# Altium project usb_hub.PrjPCB
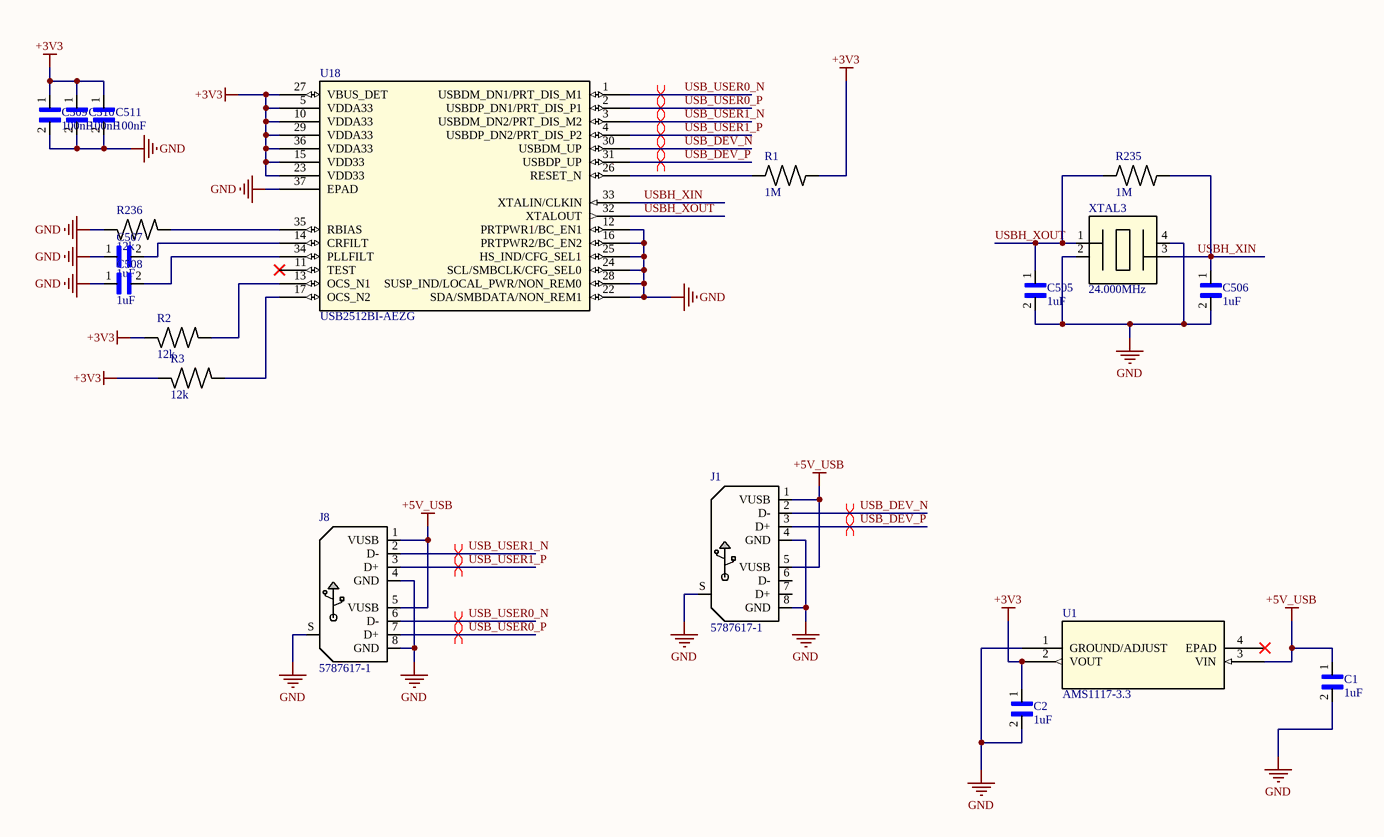
[diagram p0: usb_hub.SchDoc]
1 sheet, 19 parts. Net scope: global (net labels, ports and power ports of the same name join across sheets).
Board file: usb_hub.PcbDoc

## Sheet usb_hub.SchDoc
size A3

### Parts
C1  1uF  [*CAPC1608X90N]
C2  1uF  [*CAPC1608X90N]
C505  1uF  [*CAPC1608X90N]
C506  1uF  [*CAPC1608X90N]
C507  1uF  [*CAPC1608X90N]
C508  1uF  [*CAPC1608X90N]
C509  100nF  [*CAPC1608X90N]
C510  100nF  [*CAPC1608X90N]
C511  100nF  [*CAPC1608X90N]
J1  5787617-1  [CONN8_5787617-1_TEC]
J8  5787617-1  [CONN8_5787617-1_TEC]
R1  1M  [*RESC1608X55N]
R2  12k  [*RESC1608X55N]
R3  12k  [*RESC1608X55N]
R235  1M  [*RESC1608X55N]
R236  12k  [*RESC1608X55N]
U1  AMS1117-3.3  [SOT_AMS_ADS]
U18  USB2512BI-AEZG  [QFN36_6X6MC_MCH]
XTAL3  24.000MHz  [SMD-4_2P5X2_AVX]

### Nets
+3V3: C2.1 C509.1 C510.1 C511.1 R1.2 R2.1 R3.1 U1.2(VOUT) U18.5(VDDA33) U18.10(VDDA33) U18.15(VDD33) U18.23(VDD33) U18.27(VBUS_DET) U18.29(VDDA33) U18.36(VDDA33)
+5V_USB: C1.1 J1.1(VUSB) J1.5(VUSB) J8.1(VUSB) J8.5(VUSB) U1.3(VIN)
GND: C1.2 C2.2 C505.2 C506.2 C507.1 C508.1 C509.2 C510.2 C511.2 J1.4(GND) J1.8(GND) J1.S J8.4(GND) J8.8(GND) J8.S R236.1 U1.1(GROUND/ADJUST) U18.12(PRTPWR1/BC_EN1) U18.16(PRTPWR2/BC_EN2) U18.22(SDA/SMBDATA/NON_REM1) U18.24(SCL/SMBCLK/CFG_SEL0) U18.25(HS_IND/CFG_SEL1) U18.28(SUSP_IND/LOCAL_PWR/NON_REM0) U18.37(EPAD) XTAL3.2(GND) XTAL3.4(GND(NC))
USB_DEV_N: J1.2(D-) U18.30(USBDM_UP)
USB_DEV_P: J1.3(D+) U18.31(USBDP_UP)
USB_USER0_N: J8.6(D-) U18.1(USBDM_DN1/PRT_DIS_M1)
USB_USER0_P: J8.7(D+) U18.2(USBDP_DN1/PRT_DIS_P1)
USB_USER1_N: J8.2(D-) U18.3(USBDM_DN2/PRT_DIS_M2)
USB_USER1_P: J8.3(D+) U18.4(USBDP_DN2/PRT_DIS_P2)
USBH_XIN: C506.1 R235.2 U18.33(XTALIN/CLKIN) XTAL3.3(HOT)
USBH_XOUT: C505.1 R235.1 U18.32(XTALOUT) XTAL3.1(HOT)
NetC507_2: C507.2 U18.14(CRFILT)
NetC508_2: C508.2 U18.34(PLLFILT)
NetR1_1: R1.1 U18.26(RESET_N)
NetR2_2: R2.2 U18.13(OCS_N1)
NetR3_2: R3.2 U18.17(OCS_N2)
NetR236_2: R236.2 U18.35(RBIAS)

Not connected (* = marked no-connect by the designer): J1 6(D-) 7(D+); U1 4(EPAD)*; U18 11(TEST)*

### Layout directives
differential pair; differential pair class USB_DEV_D: USB_DEV_N, USB_DEV_P
differential pair; differential pair class USB_USR0_D: USB_USER0_N, USB_USER0_P
differential pair; differential pair class USB_USR1_D: USB_USER1_N, USB_USER1_P

### Library data of the parts
C1 C2 C505-C511 = 06033C103KAT2A: 0603 10 nF 25 V 10% Tolerance X7R Surface Mount Multilayer Ceramic Capacitor; MF: AVX; Package: 1608 AVX; MP: 06033C103KAT2A; Price: None; Availability: Unavailable; SnapEDA_Link: https://www.snapeda.com/parts/06033C103KAT2A/AVX%20/%20Kyocera/view-part/?ref=snap; Value: *
J1 J8 = 5787617-1: RECP ASSY, R/A, STACKED, THRU-HOLE, USB,; Vendor: TE Connectivity; ROWS/CONFIG: 2; PITCH(MM): 2.5; POSITIONS: 8; Built_By: EMA_UL_Team; SourceLibrary: TE_Connectivity-2018-03-16; Copyright: Copyright (C) 2016 Accelerated Designs. All rights reserved; Manufacturer_Part_Number: 5787617-1; TE_Part_Number: 5787617-1; PRODUCT: Connector; Type: DEV; RefDes: RefDes
R1-R3 R235 R236 = CR0603-FX-4701ELF: Res Thick Film 0603 4.7K Ohm 1% 1/10W 100ppm/C Molded SMD SMD Paper Tape on Plastic Reel; MF: Bourns; MP: CR0603-FX-4701ELF; Package: 1608 Rohm Semiconductor; Price: None; SnapEDA_Link: https://www.snapeda.com/parts/CR0603-FX-4701ELF/Bourns/view-part/?ref=snap; Availability: Unavailable; Value: *
U1 = AMS1117-3.3: No Description Available; Vendor: Advanced Monolithic Systems; Built_By: EMA_Matt; SourceLibrary: Advanced_Monolithic_Systems_10-16-2019; Copyright: Copyright (C) 2018 Accelerated Designs. All rights reserved; Manufacturer_Part_Number: AMS1117-3.3; RefDes: RefDes; Type: DEV
U18 = USB2512BI-AEZG: No Description Available; Vendor: Microchip; Built_By: EMA_Jessica; SourceLibrary: Microchip_2019-08-23_1; Manufacturer_Part_Number: USB2512BI-AEZG; Copyright: Copyright (C) 2018 Accelerated Designs. All rights reserved; RefDes: RefDes; Type: DEV
XTAL3 = CX2520DB25000H0FLJC1: No Description Available; Vendor: AVX Corporation; Built_By: EMA_Anthony; SourceLibrary: AVX_2020-03-05; Datasheet: https://media.digikey.com/pdf/Data%20Sheets/AVX%20PDFs/CX2520DB_USY1M-H1-16429-00_Spec.pdf; Manufacturer_Part_Number: CX2520DB25000H0FLJC1; Copyright: Copyright (C) 2018 Accelerated Designs. All rights reserved; RefDes: RefDes; Type: DEV